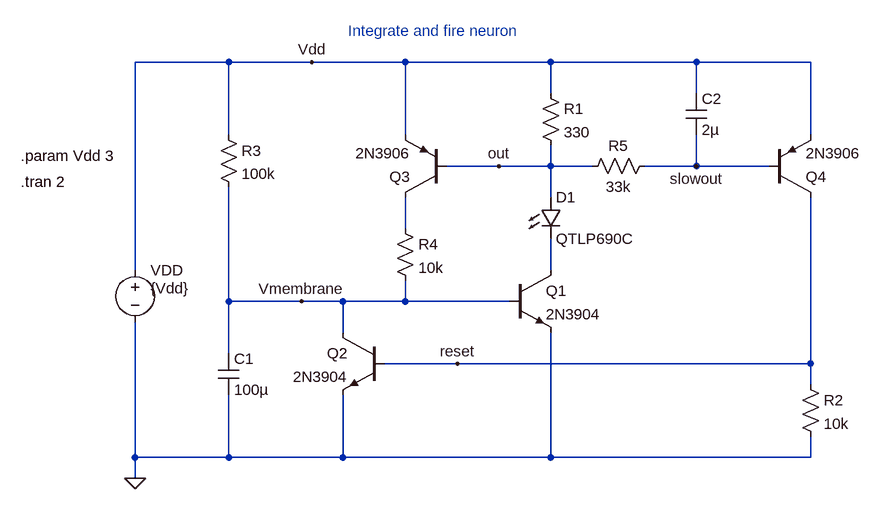
[diagram p0: schematic spike1.asc]
spike1.asc, the LTspice schematic file:
Version 4
SHEET 1 900 680
WIRE -112 -192 -256 -192
WIRE 16 -192 -112 -192
WIRE 160 -192 16 -192
WIRE 384 -192 160 -192
WIRE 608 -192 384 -192
WIRE 784 -192 608 -192
WIRE 384 -144 384 -192
WIRE 608 -144 608 -192
WIRE -112 -80 -112 -192
WIRE 160 -80 160 -192
WIRE 784 -80 784 -192
WIRE 304 -32 224 -32
WIRE 384 -32 384 -64
WIRE 384 -32 304 -32
WIRE 448 -32 384 -32
WIRE 608 -32 608 -80
WIRE 608 -32 528 -32
WIRE 720 -32 608 -32
WIRE 384 16 384 -32
WIRE 160 64 160 16
WIRE -256 128 -256 -192
WIRE 384 128 384 80
WIRE -112 176 -112 0
WIRE 0 176 -112 176
WIRE 64 176 0 176
WIRE 160 176 160 144
WIRE 160 176 64 176
WIRE 320 176 160 176
WIRE 64 224 64 176
WIRE -112 256 -112 176
WIRE 240 272 128 272
WIRE 784 272 784 16
WIRE 784 272 240 272
WIRE 784 304 784 272
WIRE -256 416 -256 208
WIRE -112 416 -112 320
WIRE -112 416 -256 416
WIRE 64 416 64 320
WIRE 64 416 -112 416
WIRE 384 416 384 224
WIRE 384 416 64 416
WIRE 784 416 784 384
WIRE 784 416 384 416
WIRE -256 448 -256 416
FLAG -256 448 0
FLAG 0 176 Vmembrane
FLAG 16 -192 Vdd
FLAG 304 -32 out
FLAG 240 272 reset
FLAG 608 -32 slowout
SYMBOL npn 320 128 R0
SYMATTR InstName Q1
SYMATTR Value 2N3904
SYMBOL voltage -256 112 R0
WINDOW 3 24 44 Left 0
WINDOW 123 0 0 Left 0
WINDOW 39 0 0 Left 0
SYMATTR Value {Vdd}
SYMATTR InstName VDD
SYMBOL cap -128 256 R0
SYMATTR InstName C1
SYMATTR Value 100µ
SYMBOL npn 128 224 M0
SYMATTR InstName Q2
SYMATTR Value 2N3904
SYMBOL res 368 -160 R0
SYMATTR InstName R1
SYMATTR Value 330
SYMBOL res 768 288 R0
SYMATTR InstName R2
SYMATTR Value 10k
SYMBOL res -128 -96 R0
SYMATTR InstName R3
SYMATTR Value 100k
SYMBOL LED 368 16 R0
SYMATTR InstName D1
SYMATTR Value QTLP690C
SYMATTR Description Diode
SYMATTR Type diode
SYMBOL pnp 224 16 R180
SYMATTR InstName Q3
SYMATTR Value 2N3906
SYMBOL res 144 48 R0
SYMATTR InstName R4
SYMATTR Value 10k
SYMBOL pnp 720 16 M180
SYMATTR InstName Q4
SYMATTR Value 2N3906
SYMBOL cap 592 -144 R0
SYMATTR InstName C2
SYMATTR Value 2µ
SYMBOL res 544 -48 R90
WINDOW 0 0 56 VBottom 0
WINDOW 3 32 56 VTop 0
SYMATTR InstName R5
SYMATTR Value 33k
TEXT -432 -48 Left 0 !.param Vdd 3
TEXT -432 -8 Left 0 !.tran 2
TEXT 72 -240 Left 0 ;Integrate and fire neuron

The netlist it stands for:
* spike1.asc
Q1 N002 Vmembrane 0 0 2N3904
VDD Vdd 0 {Vdd}
C1 Vmembrane 0 100µ
Q2 Vmembrane reset 0 0 2N3904
R1 Vdd out 330
R2 reset 0 10k
R3 Vdd Vmembrane 100k
D1 out N002 QTLP690C
Q3 N001 out Vdd 0 2N3906
R4 N001 Vmembrane 10k
Q4 reset slowout Vdd 0 2N3906
C2 Vdd slowout 2µ
R5 slowout out 33k
.model D D
.lib standard.dio
.model NPN NPN
.model PNP PNP
.lib standard.bjt
.param Vdd 3
.tran 2
* Integrate and fire neuron
.backanno
.end